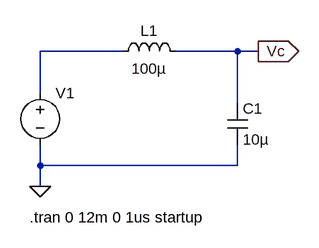
[diagram p0: schematic LC circuit.asc]
LC circuit.asc, the LTspice schematic file:
Version 4
SHEET 1 880 680
WIRE 288 208 160 208
WIRE 464 208 368 208
WIRE 496 208 464 208
WIRE 160 272 160 208
WIRE 464 288 464 208
WIRE 160 384 160 352
WIRE 464 384 464 352
WIRE 464 384 160 384
WIRE 160 416 160 384
FLAG 160 416 0
FLAG 496 208 Vc
IOPIN 496 208 Out
SYMBOL voltage 160 256 R0
WINDOW 3 24 96 Invisible 2
WINDOW 123 0 0 Left 2
WINDOW 39 0 0 Left 2
SYMATTR Value PULSE(0 1 0 1u 1u 3.179m 6.358m)
SYMATTR InstName V1
SYMBOL ind 272 224 R270
WINDOW 0 32 56 VTop 2
WINDOW 3 5 56 VBottom 2
SYMATTR InstName L1
SYMATTR Value 100µ
SYMATTR SpiceLine Ipk=1 Rser=85m Rpar=infin. Cpar=0 mfg="Coiltronics" pn="CTX100-1-52"
SYMBOL cap 448 288 R0
SYMATTR InstName C1
SYMATTR Value 10µ
TEXT 144 464 Left 2 !.tran 0 12m 0 1us startup

The netlist it stands for:
* LC circuit.asc
V1 N001 0 PULSE(0 1 0 1u 1u 3.179m 6.358m)
L1 N001 Vc 100µ Ipk=1 Rser=85m Rpar=infin. Cpar=0 mfg="Coiltronics" pn="CTX100-1-52"
C1 Vc 0 10µ
.tran 0 12m 0 1us startup
.backanno
.end